# EAGLE design box2043_rfm96V4 (EAGLE 8.6.1)
Tiny TX Node for RMD Box 2043
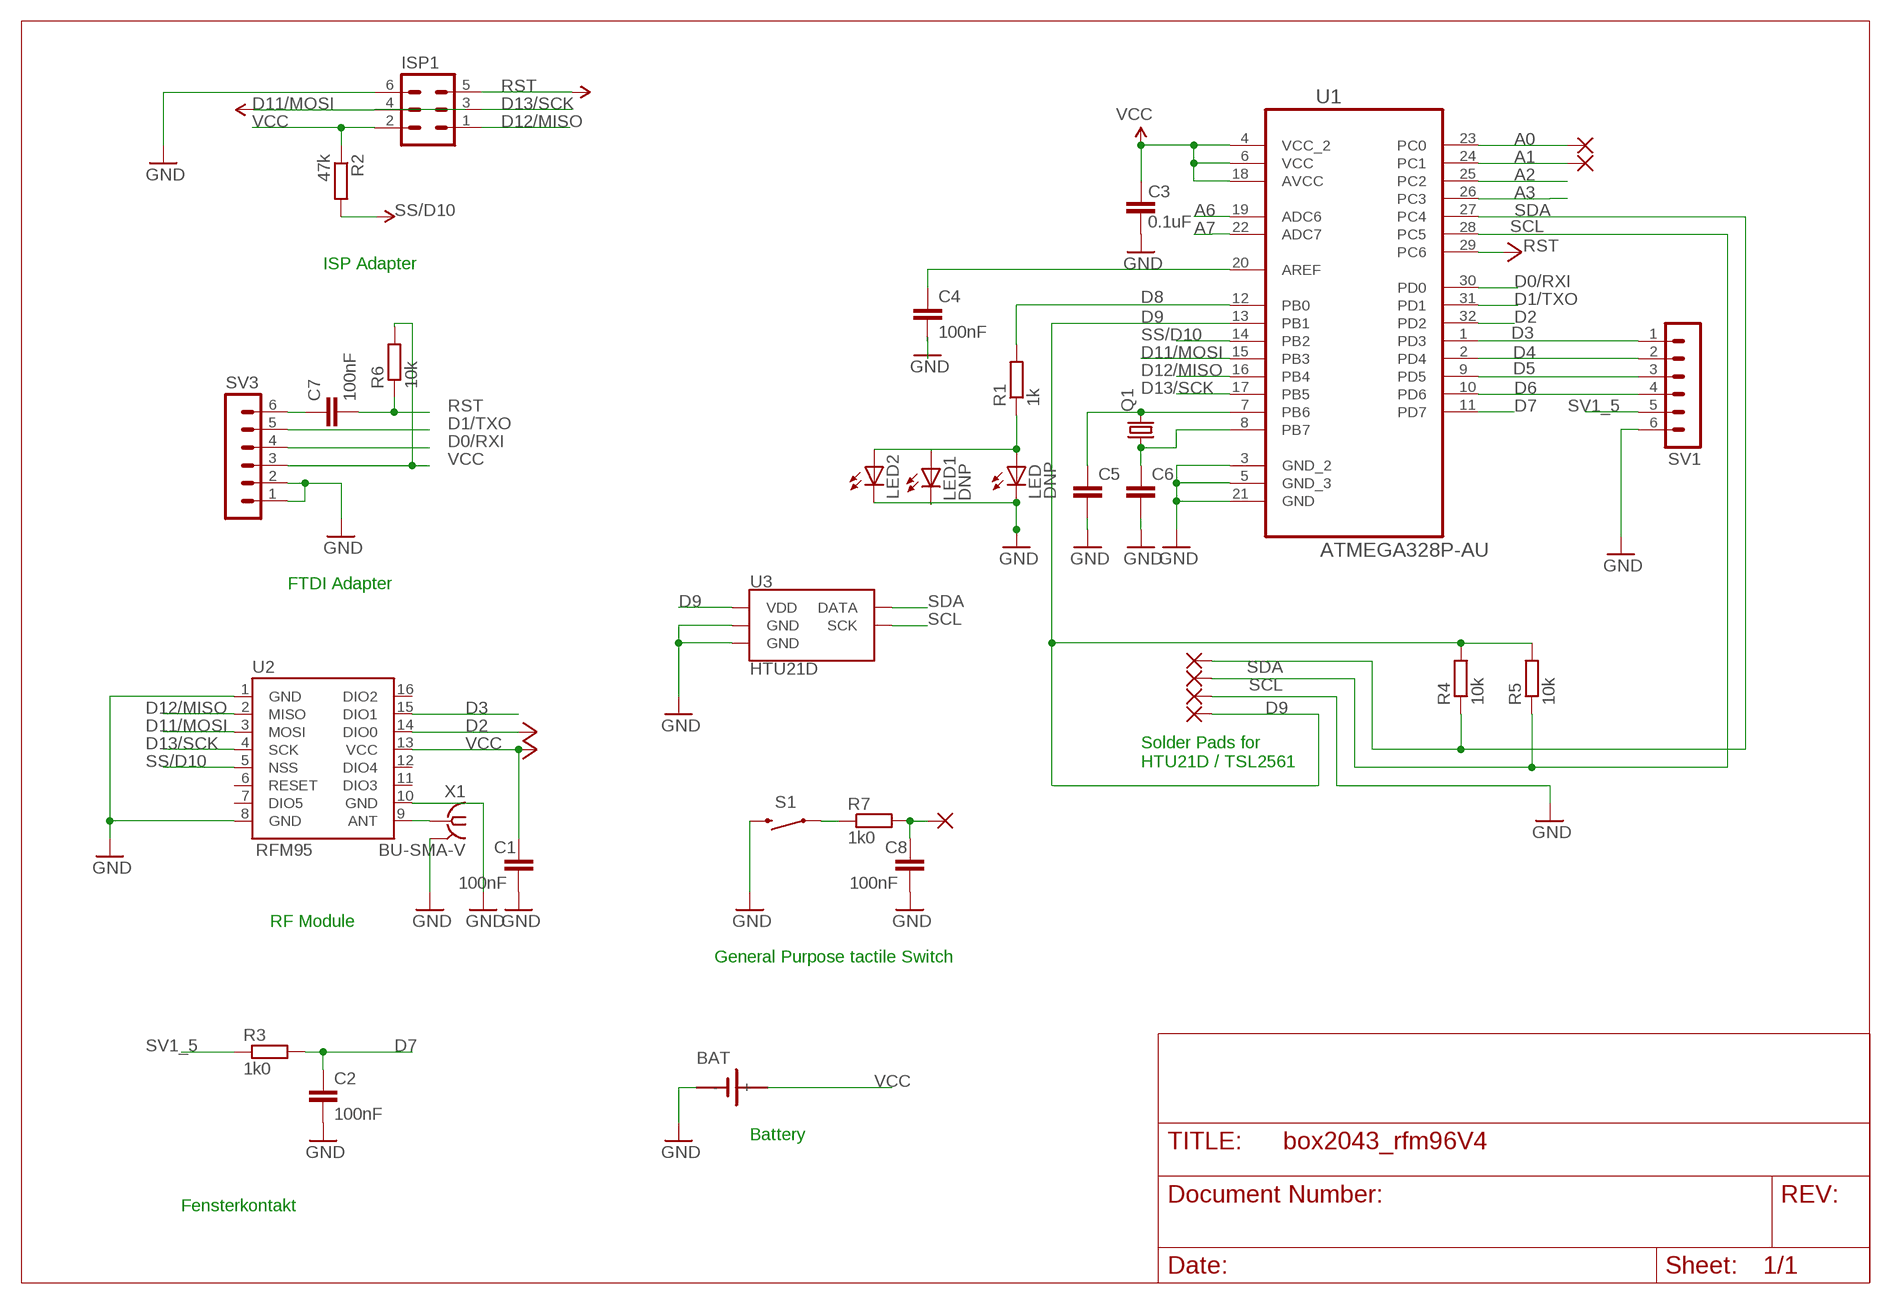
[diagram p0: schematic, sheet 1]

## Parts
A0  SMD2  [SMD1,27-2,54]
A1  SMD2  [SMD1,27-2,54]
BAT  SN2032  [SN2032]
C1  100nF  C-EUC0603  [C0603]
C2  100nF  C-EUC0603  [C0603]
C3  0.1uF  CAP0603-CAP  [0603-CAP]
C4  100nF  C-EUC0603  [C0603]
C5  C-EUC0402  [C0402]
C6  C-EUC0402  [C0402]
C7  100nF  C-EUC0603  [C0603]
C8  100nF  C-EUC0603  [C0603]
D9  SMD2  [SMD1,27-2,54]
GND  SMD2  [SMD1,27-2,54]
ISP1  MA03-2  [MA03-2]
LED  DNP  LEDCHIPLED_0603  [CHIPLED_0603]
LED1  DNP  LED3MM  [LED3MM]
LED2  LEDCHIPLED_0603  [CHIPLED_0603]
N1  SMD2  [SMD1,27-2,54]
Q1  CRYSTALTC26V  [TC26V]
R1  1k  R-EU_R0603  [R0603]
R2  47k  R-EU_R0603  [R0603]
R3  1k0  R-EU_R0603  [R0603]
R4  10k  R-EU_R0603  [R0603]
R5  10k  R-EU_R0603  [R0603]
R6  10k  R-EU_R0603  [R0603]
R7  1k0  R-EU_R0603  [R0603]
S1  MOMENTARY-SWITCH-SPST-PTH-RIGHT-ANGLE  [TACTILE_SWITCH_PTH_RIGHT_ANGLE]
SCL  SMD2  [SMD1,27-2,54]
SDA  SMD2  [SMD1,27-2,54]
SV1  MA06-1  [MA06-1]
SV3  MA06-1  [MA06-1]
U1  ATMEGA328P-AU  [QFP80P900X900X120-32N]
U2  RFM95  [RFM95/96]
U3  HTU21D  [DFN-6-3X3-HTU21D]
X1  BU-SMA-V  [BU-SMA-V]

## Nets
A0: A0.1(P) U1.23(PC0)
A1: A1.1(P) U1.24(PC1)
A2: U1.25(PC2)
A3: U1.26(PC3)
A6: U1.19(ADC6)
A7: U1.22(ADC7)
D0/RXI: SV3.4 U1.30(PD0)
D1/TXO: SV3.5 U1.31(PD1)
D2: U1.32(PD2) U2.14(DIO0)
D3: SV1.1 U1.1(PD3) U2.15(DIO1)
D4: SV1.2 U1.2(PD4)
D5: SV1.3 U1.9(PD5)
D6: SV1.4 U1.10(PD6)
D7: C2.1 R3.2 U1.11(PD7)
D8: R1.2 U1.12(PB0)
D9: D9.1(P) R4.2 R5.2 U1.13(PB1) U3.VDD
D11/MOSI: ISP1.4 U1.15(PB3) U2.3(MOSI) ; supply symbol labelled D13/SCK
D12/MISO: ISP1.1 U1.16(PB4) U2.2(MISO)
D13/SCK: ISP1.3 U1.17(PB5) U2.4(SCK)
DTR: C7.1 SV3.6
GND: BAT.- C1.2 C2.2 C3.1 C4.2 C5.2 C6.2 C8.2 GND.1(P) ISP1.6 LED1.K(C) LED2.C LED.C S1.2 SV1.6 SV3.1 SV3.2 U1.3(GND_2) U1.5(GND_3) U1.21(GND) U2.1(GND) U2.8(GND) U2.10(GND) U3.7(GND) U3.GND X1.2 X1.3 X1.4 X1.5
N$1: U2.9(ANT) X1.1
N$4: C5.1 Q1.2 U1.7(PB6)
N$6: C4.1 U1.20(AREF)
N$7: R7.1 S1.1
N$8: LED1.A LED2.A LED.A R1.1
N$9: C6.1 Q1.1 U1.8(PB7)
N$10: C8.1 N1.1(P) R7.2
RST: C7.2 ISP1.5 R6.1 U1.29(PC6) ; supply symbol labelled VCC
SCL: R5.1 SCL.1(P) U1.28(PC5) U3.SCK
SDA: R4.1 SDA.1(P) U1.27(PC4) U3.DATA
SS/D10: R2.2 U1.14(PB2) U2.5(NSS) ; supply symbol labelled VCC
SV1_5: R3.1 SV1.5
VCC: BAT.+ C1.1 C3.2 ISP1.2 R2.1 R6.2 SV3.3 U1.4(VCC_2) U1.6(VCC) U1.18(AVCC) U2.13(VCC)
Unconnected: U2.7(DIO5) U2.11(DIO3) U2.12(DIO4) U2.16(DIO2)

## Notes on the sheet
- ISP Adapter
- FTDI Adapter
- Solder Pads for
  HTU21D / TSL2561
- RF Module
- General Purpose tactile Switch
- Battery
- Fensterkontakt

## Power pins joined to a net without a drawn wire
RESET: U2.6(RESET)

## Library data of the parts
A0 A1 D9 GND N1 SCL SDA = wirepad:SMD2: SMD PAD
BAT = sn2032_AH:SN2032: LI BATTERY
C1 C2 C4-C8 = rcl:C-EU: CAPACITOR, European symbol; SPICEPREFIX: C
C3 = SparkFun:CAP: Capacitor Standard 0603 ceramic capacitor, and 0.1" leaded capacitor.
ISP1 = con-lstb:MA03-2: PIN HEADER; OC_FARNELL: unknown; OC_NEWARK: unknown
LED LED1 LED2 = led:LED: LED OSRAM: - CHIPLED LG R971, LG N971, LY N971, LG Q971, LY Q971, LO R971, LY R971 LH N974, LH R974 LS Q976, LO Q976, LY Q976 LO Q996 - Hyper CHIPLED LW Q18S LB Q993, LB Q99A, LB R99A - SideLED LS A670, LO A670, LY A670, LG A670, LP A670 LB A673, LV A673, LT A673, LW A673 LH A674 LY A675 LS A676, LA A676, LO A676, LY A676, LW A676 LS A679, LY A679, LG A679 - Hyper Micro SIDELED® LS Y876, LA Y876, LO Y876, LY Y876 LT Y87S - SmartLED LW L88C, LW L88S LB L89C, LB L89S, LG L890 LS L89K, LO L89K, LY L89K LS L896, LA L896, LO L896, LY L896 - TOPLED LS T670, LO T670, LY T670, LG T670, LP T670 LSG T670, LSP T670, LSY T670, LOP T670, LYG T670 LG T671, LOG T671, LSG T671 LB T673, LV T673, LT T673, LW T673 LH T674 LS T676, LA T676, LO T676, LY T676, LB T676, LH T676, LSB T676, LW T676 LB T67C, LV T67C, LT T67C, LS T67K, LO T67K, LY T67K, LW E67C LS E67B, LA E67B, LO E67B, LY E67B, LB E67C, LV E67C, LT E67C LW T67C LS T679, LY T679, LG T679 LS T770, LO T770, LY T770, LG T770, LP T770 LB T773, LV T773, LT T773, LW T773 LH T774 LS E675, LA E675, LY E675, LS T675 LS T776, LA T776, LO T776, LY T776, LB T776 LHGB T686 LT T68C, LB T68C - Hyper Mini TOPLED® LB M676 - Mini TOPLED Santana® LG M470 LS M47K, LO M47K, LY M47K Source: http://www.osram.convergy.de LUXEON: - LUMILED® LXK2-PW12-R00, LXK2-PW12-S00, LXK2-PW14-U00, LXK2-PW14-V00 LXK2-PM12-R00, LXK2-PM12-S00, LXK2-PM14-U00 LXK2-PE12-Q00, LXK2-PE12-R00, LXK2-PE12-S00, LXK2-PE14-T00, LXK2-PE14-U00 LXK2-PB12-K00, LXK2-PB12-L00, LXK2-PB12-M00, LXK2-PB14-N00, LXK2-PB14-P00, LXK2-PB14-Q00 LXK2-PR12-L00, LXK2-PR12-M00, LXK2-PR14-Q00, LXK2-PR14-R00 LXK2-PD12-Q00, LXK2-PD12-R00, LXK2-PD12-S00 LXK2-PH12-R00, LXK2-PH12-S00 LXK2-PL12-P00, LXK2-PL12-Q00, LXK2-PL12-R00 Source: www.luxeon.com KINGBRIGHT: KA-3528ASYC Source: www.kingbright.com
Q1 = crystal:CRYSTAL: CRYSTAL; OC_FARNELL: unknown; OC_NEWARK: unknown
R1-R7 = rcl:R-EU_: RESISTOR, European symbol
S1 = SparkFun-Switches:MOMENTARY-SWITCH-SPST: Momentary Switch (Pushbutton) - SPST Normally-open (NO) SPST momentary switches (buttons, pushbuttons). Variants PTH-12MM - 12mm square, through-hole Momentary Pushbutton Switch - 12mm Square <https://www.sparkfun.com/products/9190> (COM-09190) PTH-6.0MM, PTH-6.0MM-KIT - 6.0mm square, through-hole Mini Pushbutton Switch <https://www.sparkfun.com/products/97> (COM-00097) KIT package intended for soldering kit's - only one side of pads' copper is exposed. PTH-RIGHT-ANGLE-KIT - Right-angle, through-hole Right Angle Tactile Button <https://www.sparkfun.com/products/10791> - Used on SparkFun BigTime Watch Kit <https://www.sparkfun.com/products/11734> SMD-12MM - 12mm square, surface-mount Tactile Button - SMD (12mm) <https://www.sparkfun.com/products/12993> (COM-12993) Used on SparkFun PicoBoard <https://www.sparkfun.com/products/11888> SMD-4.5MM - 4.5mm Square Trackball Switch Used on SparkFun Blackberry Trackballer Breakout <https://www.sparkfun.com/products/13169> SMD-4.6MMX2.8MM - 4.60mm x 2.80mm, surface mount Used on SparkFun SAMD21 Mini Breakout <https://www.sparkfun.com/products/13664> SMD-5.2MM, SMD-5.2-REDUNDANT - 5.2mm square, surface-mount Mini Pushbutton Switch - SMD <https://www.sparkfun.com/products/8720> (COM-08720) Used on Arduino Pro Mini <https://www.sparkfun.com/products/11114> REDUNDANT package connects both switch circuits together SMD-6.0X3.5MM - 6.0 x 3.5mm, surface mount Momentary Reset Switch SMD <https://www.sparkfun.com/products/8229> (COM-08229) SMD-6.2MM-TALL - 6.2mm square, surface mount Tactile Button - SMD (6mm) <https://www.sparkfun.com/products/12992> Used on SparkFun Digital Sandbox <https://www.sparkfun.com/products/12651> SMD-RIGHT-ANGLE - Right-angle, surface mount Used on SparkFun Block for Intel® Edison - Arduino <https://www.sparkfun.com/products/13036>; PROD_ID: CONN-10672; SF_SKU: COM-10791
SV1 SV3 = con-lstb:MA06-1: PIN HEADER; OC_FARNELL: unknown; OC_NEWARK: unknown
U1 = Atmel_By_element14_Batch_1-00:ATMEGA328P-AU: 8-bit Microcontroller with In-System Programmable Flash; MPN: ATMEGA328P-AU; OC_FARNELL: 1715486; OC_NEWARK: 14R4631; PACKAGE: TQFP-32; SUPPLIER: Atmel
U2 = RFM69xx:RFM95: Low Power Long Range Transceiver Module. The RFM95/96/97/98(W) transceivers feature the LoRaTM long range modem that provides ultra-long range spread spectrum communication and high interference immunity whilst minimising current consumption.
U3 = SparkFun-Sensors:HTU21D: Measurement Specialties HTU21D Relative Humidity Sensor w/ Temperature HTU21D(F) digital humidity sensors are dedicated humidity and temperature plug and play transducers for OEM applications where reliable and accurate measurements are needed. Direct interface with a micro-controller is made possible with the module for humidity and temperature digital outputs. These low power sensors are designed for high volume and cost sensitive applications with tight space constraints. Datasheet <http://cdn.sparkfun.com/datasheets/BreakoutBoards/HTU21D.pdf> SparkFun Products SparkFun Humidity and Temperature Sensor Breakout - HTU21D <https://www.sparkfun.com/products/12064> (SEN-12064) SparkFun Weather Shield <https://www.sparkfun.com/products/12081> (SEN-12081) SparkFun Photon Weather Shield <https://www.sparkfun.com/products/13630> (SEN-13630); PROD_ID: IC-11793
X1 = con-coax:BU-SMA-V: FEMALE SMA CONNECTOR Radiall distributor RS 112-3794; OC_FARNELL: unknown; OC_NEWARK: unknown

## Net classes
1 vcc: width 0.254 mm

## Board
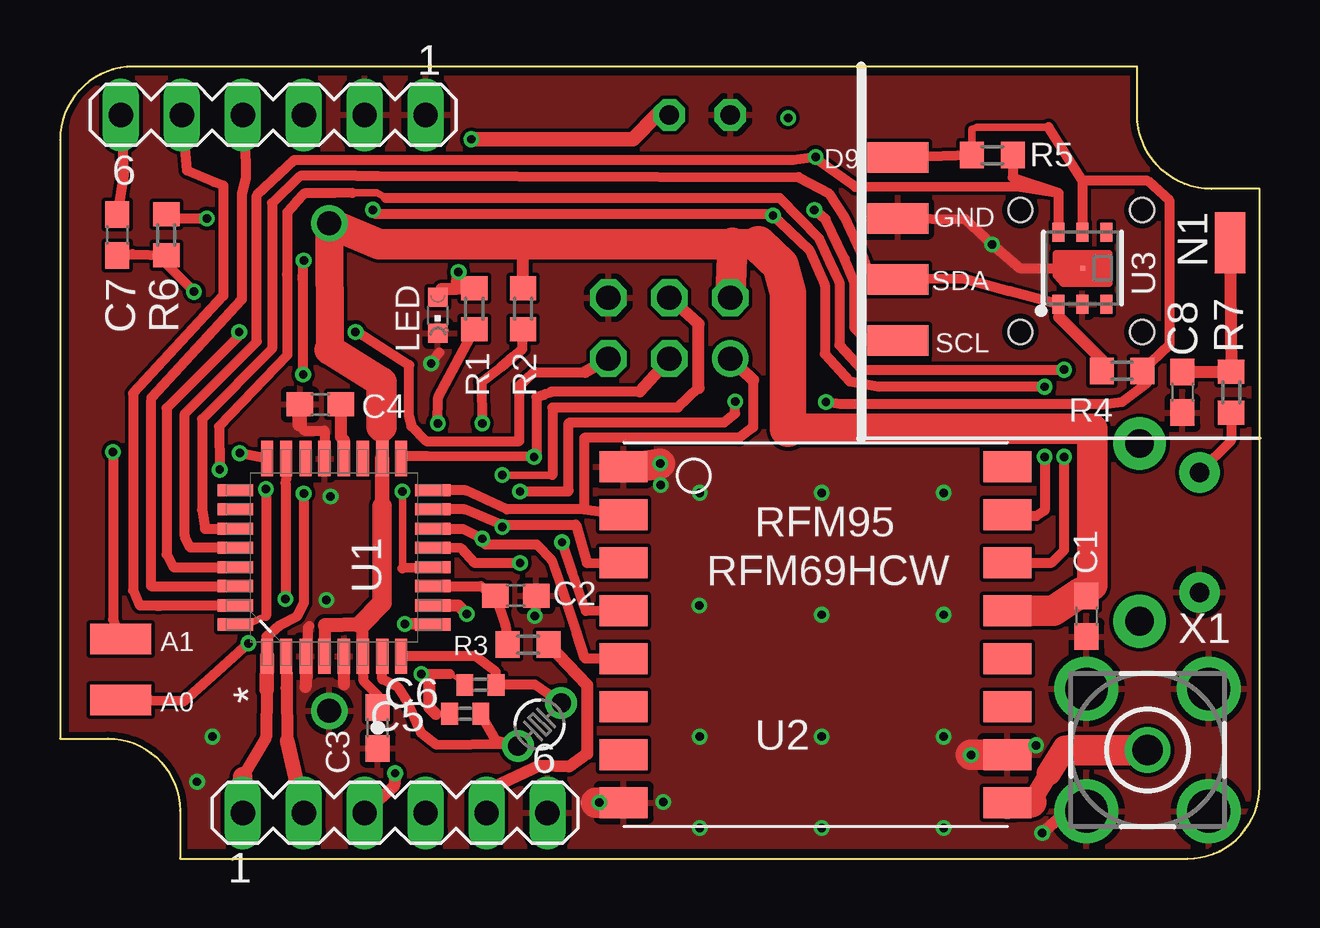
[diagram p1: board, top side]
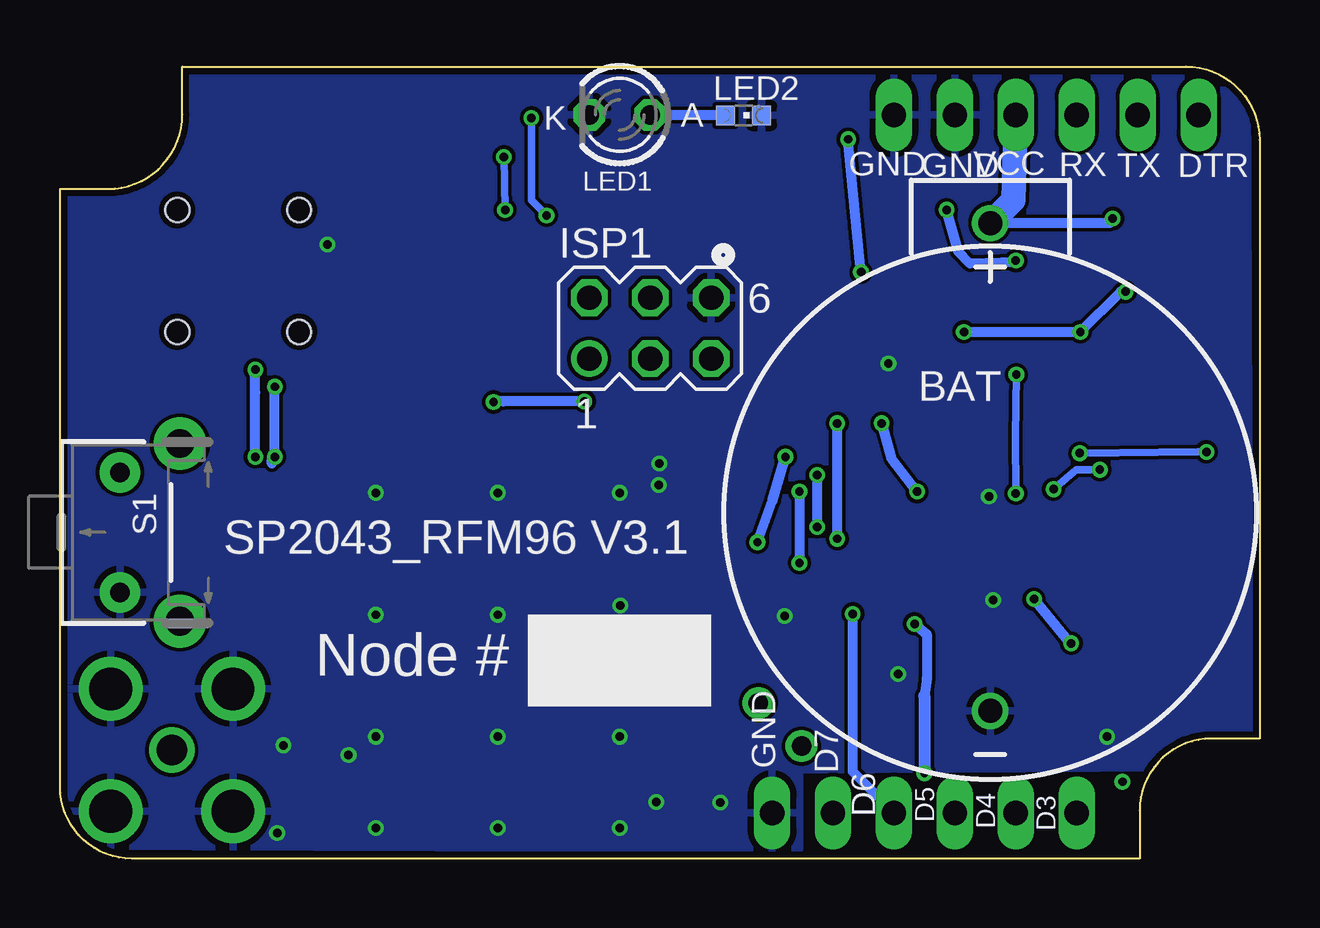
[diagram p2: board, bottom side, seen from below]

Size 50 x 33 mm. Coordinates in mm from the lower left corner, seen from the top.
Outline: 50,27.9 48,27.9 arc-90 44.9,31 44.9,33 3.06,33 arc90 0,29.93 0,5 2,5 arc-90 5,2 5,0 47,0 arc90 50,3 50,27.9
Copper layers (1*16): Top 0.035mm / dielectric 1.5mm / Bottom 0.035mm
Design rules "SeeedStudio_2layer_DRU_no_angle_20140221": minimum track width 6mil, minimum drill 12mil, track to track 6mil, track to pad 6mil, pad to pad 6mil, via to via 6mil, smd to smd 0mil, copper to edge 10mil, drill to drill 10mil, minimum pad ring 10mil, minimum via ring 6mil, stop-mask expansion 2mil, vias tented up to drill 100mil, thermal gap 10mil
Holes 1 mm at 45.11,27.03 40.03,27.03 45.11,21.95 40.03,21.95

### Footprints (pad centres in the part's own frame; a part is rotated, then mirrored left to right if it is on the bottom)
SMD1,27-2,54 = smd 1.27 x 2.54: 1 0,0
SN2032 = drill 1: + 0,12.065; - 0,-8.255
C0603 = smd 1.1 x 1: 1 -0.85,0; 2 0.85,0
0603-CAP = smd 1.1 x 1: 1 -0.85,0; 2 0.85,0
C0402 = smd 0.7 x 0.9: 1 -0.65,0; 2 0.65,0
MA03-2 = drill 1.016: 1 -2.54,-1.27 | drill 1.016 octagon: 2 -2.54,1.27; 3 0,-1.27; 4 0,1.27; 5 2.54,-1.27; 6 2.54,1.27
CHIPLED_0603 = smd 0.8 x 0.8: A 0,-0.75; C 0,0.75
LED3MM = drill 0.813 octagon: A -1.27,0; K 1.27,0
TC26V = drill 0.813: 1 -1.27,0; 2 1.27,0
R0603 = smd 1 x 1.1: 1 -0.85,0; 2 0.85,0
TACTILE_SWITCH_PTH_RIGHT_ANGLE = drill 0.8 pad 1.7: 1 -2.5,0; 2 2.5,0 | drill 1.2 pad 2.2: ANCHOR1 -3.703,2.5; ANCHOR2 3.703,2.5
MA06-1 = drill 1.016 long: 1 -6.35,0; 2 -3.81,0; 3 -1.27,0; 4 1.27,0; 5 3.81,0; 6 6.35,0
QFP80P900X900X120-32N = smd 1.473 x 0.508: 1 -4.115,2.794; 2 -4.115,2.007; 3 -4.115,1.194; 4 -4.115,0.406; 5 -4.115,-0.406; 6 -4.115,-1.194; 7 -4.115,-2.007; 8 -4.115,-2.794; 17 4.115,-2.794; 18 4.115,-2.007; 19 4.115,-1.194; 20 4.115,-0.406; 21 4.115,0.406; 22 4.115,1.194; 23 4.115,2.007; 24 4.115,2.794 | smd 0.508 x 1.473: 9 -2.794,-4.115; 10 -2.007,-4.115; 11 -1.194,-4.115; 12 -0.406,-4.115; 13 0.406,-4.115; 14 1.194,-4.115; 15 2.007,-4.115; 16 2.794,-4.115; 25 2.794,4.115; 26 2.007,4.115; 27 1.194,4.115; 28 0.406,4.115; 29 -0.406,4.115; 30 -1.194,4.115; 31 -2.007,4.115; 32 -2.794,4.115
RFM95/96 = smd 2 x 1.3: 1 -8,8; 2 -8,6; 3 -8,4; 4 -8,2; 5 -8,0; 6 -8,-2; 7 -8,-4; 8 -8,-6; 9 8,-6; 10 8,-4; 11 8,-2; 12 8,0; 13 8,2; 14 8,4; 15 8,6; 16 8,8
DFN-6-3X3-HTU21D = smd 0.2 x 0.2: 7 0,0 | smd 0.8 x 0.5: DATA 1.5,-1; GND 1.5,0; NC@1 -1.5,1; NC@6 1.5,1; SCK -1.5,-1; VDD -1.5,0
BU-SMA-V = drill 1.27: 1 0,0 | drill 1.778: 2 -2.55,2.55; 3 2.55,2.55; 4 2.55,-2.55; 5 -2.55,-2.55

### Placement (x,y rotation side)
A0  2.54,6.6 90 top
A1  2.54,9.14 90 top
BAT  11.23,14.41 0 bottom
C1  42.79,10.1 270 top
C2  19,10.95 0 top
C3  13.24,5.44 90 top
C4  10.86,18.93 180 top
C5  16.89,6.03 180 top
C6  17.53,7.24 180 top
C7  2.38,25.98 270 top
C8  46.79,19.43 270 top
D9  34.92,29.21 90 top
GND  34.92,26.67 90 top
ISP1  25.4,22.1 0 bottom
LED  15.75,22.64 180 top
LED1  26.67,30.99 180 bottom
LED2  21.51,30.96 270 bottom
N1  48.77,25.65 0 top
Q1  19.99,5.59 225 top
R1  17.27,22.91 270 top
R2  19.3,22.91 270 top
R3  19.51,8.92 180 top
R4  44.27,20.32 0 top
R5  38.86,29.31 180 top
R6  4.43,25.99 90 top
R7  48.82,19.43 90 top
S1  47.5,13.59 270 bottom
SCL  34.92,21.59 90 top
SDA  34.92,24.13 90 top
SV1  13.97,1.91 0 top
SV3  8.89,30.99 180 top
U1  11.43,12.55 90 top
U2  31.5,8.33 0 top
U3  42.62,24.6 270 top
X1  45.34,4.52 0 top

### Tracks (layer width: path | path; a pad name or v marks a point on that pad's centre or on a via)
A0  (via drill 0.35)
  Top 0.305: 9.42,15.77 9.4,15.65
  Top 0.406: U1.23 9.42,15.77 | 9.4,15.65 v9.4,10.81 | v7.85,8.97 6.35,7.62 5.16,6.55 A0.1
  Bottom 0.254: 7.9,8.97 v7.85,8.97
  Bottom 0.406: v9.4,10.81 7.9,8.97
A1  (via drill 0.35)
  Top 0.406: U1.24 v7.49,16.89 | v2.21,16.94 2.21,9.96 A1.1
  Bottom 0.305: v7.49,16.89 2.56,16.94 v2.21,16.94
D0/RXI
  Top 0.305: 3.82,19.21 3.79,19.25 3.79,19.24 3.79,19.2 3.79,19.05
  Top 0.406: U1.30 7.11,11.35 3.79,11.35 3.79,19.05 | 3.82,19.21 7.57,23.29 7.57,27.69 7.75,28.36 7.75,28.98 SV3.4
D1/TXO
  Top 0.406: U1.31 4,10.54 4.22,10.54 3.33,10.54 3.05,11.17 3.05,19.39 6.81,23.45 6.81,28.05 6.43,28.19 5.28,28.68 SV3.5
D2  (via drill 0.35)
  Top 0.152: 9.47,26.7 9.47,26.93
  Top 0.305: 13.59,27.53 13.21,27.74 12.19,27.74 | 8.59,10.11 7.88,9.78 7.63,9.77 | 7.63,9.77 7.19,9.75 | U1.32 7.33,9.77 7.63,9.77
  Top 0.406: U2.14 41.34,12.33 41.86,12.85 v41.86,16.74 | v41.86,20.37 33.45,20.37 32.49,21.41 32.49,24.03 32.11,24.82 31.65,25.83 30,27.53 13.59,27.53 | v6.66,16.2 6.63,18.01 9.47,20.98 9.47,23.96 9.47,24.34 9.47,25.57 9.47,26.93 9.84,27.34 10.19,27.71 11.43,27.72 12.19,27.74 | v8.59,15.39 8.59,10.11
  Bottom 0.305: v8.59,15.39 7.64,16.2 v6.66,16.2
  Bottom 0.406: v41.86,16.74 41.86,19.43 v41.86,20.37
D3  (via drill 0.35)
  Top 0.152: 10.13,24.13 10.11,24.16 | v29.72,26.8 29.67,26.85 29.21,26.85
  Top 0.305: 39.5,14.28 U2.15 | 29.69,26.85 29.72,26.72
  Top 0.406: U1.1 8.61,9.25 9.13,9.69 9.87,10.08 10.16,10.64 v10.16,15.21 | v10.13,20.17 10.13,24.13 10.13,24.45 | 39.5,14.28 40.72,14.28 41.05,14.5 v41.05,16.74 | v41.05,19.66 34.19,19.66 32.92,19.89 31.88,21.02 31.88,23.9 31.25,25.34 30,26.53 29.69,26.85 29.21,26.85 13.15,26.85 v13.04,27.03 | 10.11,24.16 v10.16,24.92
  Top 0.508: 8.61,7.03 8.59,5.06 7.62,3.4
  Top 0.61: 8.61,7.03 U1.1
  Top 0.813: 7.62,3.4 SV1.1
  Bottom 0.305: v10.16,15.21 10.19,17.6 v10.13,20.17 | v41.05,16.74 41.05,16.82 | v30.35,30.86 30.35,27.43 v29.72,26.8
  Bottom 0.406: 41.05,16.82 v41.05,19.66 | v10.16,24.92 10.19,24.84 12.06,24.79 12.56,25.29 v13.04,27.03 | 41.18,16.46 41.18,16.61 v41.05,16.74
D4
  Top 0.508: U1.2 9.45,7.12 9.46,4.91
  Top 0.61: 9.46,4.91 SV1.2
D5  (via drill 0.35)
  Top 0.406: v13.97,3.56 13.97,3.53
  Top 0.508: U1.9 v14.38,9.78 | 13.97,3.53 13.97,3.4 13.92,3.02 SV1.3
  Bottom 0.406: v14.38,9.78 13.87,9.35 13.87,7.52 13.97,6.78
  Bottom 0.508: 13.97,6.78 v13.97,3.56
D6  (via drill 0.35)
  Top 0.508: v16.95,10.2 16.61,10.54 U1.10
  Bottom 0.406: SV1.4 16.95,3.62 v16.95,10.2
D7
  Top 0.152: C2.1 17.99,10.93 17.64,11.28
  Top 0.406: U1.11 17.55,11.35 17.64,11.28 18.16,10.79 | C2.1 18.57,9.71 R3.2
D8  (via drill 0.35)
  Top 0.305: 14.28,12.09 v14.28,15.29
  Top 0.406: U1.12 14.28,12.09 | v15.75,18.14 15.77,19.21 R1.2
  Bottom 0.406: v14.28,15.29 15.32,16.64 v15.75,18.14
D9  (via drill 0.35)
  Top 0.152: 45.1,20.34 R4.2 | D9.1 35.56,29.17
  Top 0.305: U1.13 16.74,12.93 | R5.2 38.01,30.39 38.23,30.48 41.2,30.48
  Top 0.406: v28.14,19.05 28.14,18.54 27.69,18.16 21.21,18.16 21.21,15.34 21.19,15.29 v19.18,15.29 | 16.04,12.95 16.74,12.93 17.29,12.32 v19.18,12.32 | 42.62,28.24 U3.VDD | 42.62,28.24 45.34,28.24 46.25,27.41 46.25,21.4 R4.2 | v31.93,19.02 32.54,18.95 43.66,18.95 43.46,18.92 44.28,19.02 45.29,19.79 45.12,19.95 45.1,20.34 | 41.2,30.48 42.62,28.24 | R5.2 D9.1
  Bottom 0.305: 19.18,12.21 v19.18,12.32
  Bottom 0.406: v31.93,19.02 31.77,19.05 31.52,19.05 v28.14,19.05 | v19.18,15.29 19.18,12.21
D11/MOSI  (via drill 0.35)
  Top 0.152: U2.3 23.76,12.33 24.13,12.7 | 25.36,23.41 ISP1.4
  Top 0.305: 20.52,15.98 v18.44,15.98 | v18.44,13.82 17.69,14.2 18.39,13.92
  Top 0.406: U2.3 21.96,12.31 21.5,13.92 18.39,13.92 16.87,14.55 U1.15 | 20.52,15.98 20.52,18.8 25.76,18.8 26.62,19.61
  Top 0.508: 26.62,19.61 26.62,22.28 25.36,23.41
  Bottom 0.406: v18.44,15.98 v18.44,13.82
D12/MISO
  Top 0.406: 21.84,14.55 U2.2 | 21.84,14.55 18.62,14.55 16.92,15.34 U1.16 | 28.89,19.94 28.89,17.97 28.32,17.53 21.84,17.53 21.84,14.55
  Top 0.508: 28.89,19.94 ISP1.1
D13/SCK  (via drill 0.35)
  Top 0.305: 21.36,11.91 21.34,11.96
  Top 0.406: U2.4 21.93,10.31 21.36,11.91 | U1.17 14.43,16.76 15.29,16.76 v19.76,16.74 19.86,16.63 19.86,19.24 20.23,19.36 20.44,19.42 20.47,19.46 24.16,19.46 | 21.34,11.96 v20.93,13.18
  Top 0.508: ISP1.3 24.16,19.46
  Bottom 0.406: v20.93,13.18 20.29,14.91 v19.76,16.74
DTR
  Top 0.406: SV3.6 2.65,28.5 C7.1
GND  (via drill 0.35)
  Top 0.203: 16.26,7.7 16.76,7.37 | 15.66,6.03 C5.2
  Top 0.305: U2.1 23.62,16.51 24.13,16.51 | 39.46,4.33 U2.10 | 16.76,7.37 C6.2
  Top 0.406: 9.98,18.09 10.19,17.83 11.02,17.83 U1.21 | GND.1 37.72,26.64 v38.85,25.59 40.01,24.6 U3.7 | 19.85,10.1 C2.2 | v15.47,20.62 15.81,21.09 | 10.34,7.55 10.34,9.64 10.39,9.68 | v15.06,7.7 16.26,7.7
  Top 0.508: 11.84,7.25 U1.5 | U1.3 10.24,7.14 | v40.95,1.07 41.94,1.93 X1.5 | v15.06,7.7 15.39,7.37 15.39,6.3 15.66,6.03
  Top 0.61: C4.2 9.98,18.09
  Top 0.813: 22.35,2.33 v22.48,2.34
  Top 1.016: U2.1 24.13,16.33
  Top 1.27: 24.13,16.33 v25.02,16.46 | 39.46,4.33 v37.97,4.32 | U2.8 22.35,2.33
  other vias: 25.15,2.36 25.04,15.57 40.69,4.72 19.79,10.11 11.28,15.09 11.1,10.77 6.35,5.08 5.71,3.2 26.67,15.24 31.75,15.24 36.83,15.24 31.75,10.16 36.83,10.16 26.67,5.08 31.75,5.08 36.83,5.08 26.67,1.27 31.75,1.27 36.83,1.27 26.64,10.54
  pour Bottom: 0.51,32.51 49.53,32.51 49.53,0.51 19.18,0.38 19.18,3.68 0.38,3.81
  pour Top: 0.51,0.51 0.51,32.51 49.53,32.51 49.53,0.51
  cutout Top: 14.71,8.05 17.37,8.05 17.37,5.08 14.68,5.08 14.68,8.03
N$1
  Top 0.406: U2.9 39.49,2.29
  Top 0.813: 40.49,2.34 41.22,3.56 | 41.89,4.62 42.07,4.52
  Top 1.016: 41.22,3.56 41.89,4.62
  Top 1.27: 39.49,2.29 40.49,2.34 | 42.07,4.52 X1.1
N$4
  Top 0.406: C5.1 18.17,4.92 Q1.2 18.62,4.78 15.7,4.75 15.04,5.26 14.4,6.66 14.1,7.14 13.44,7.47 U1.7
N$6
  Top 0.406: 11.84,17.45 11.71,17.57
  Top 0.508: U1.20 11.84,17.45 | 11.71,17.57 11.71,17.93 C4.1
N$7
  Top 0.406: R7.1 48.82,17.41 S1.1
N$8  (via drill 0.35)
  Top 0.305: 15.9,23.73 LED.A
  Top 0.508: R1.1 16.51,23.73 | 16.51,23.73 15.9,23.73 | 16.51,23.73 v16.61,24.43
  Top 0.61: v17.15,29.97 23.88,29.97 24.89,30.99 LED1.A
  Bottom 0.406: v16.61,24.43 v17.15,29.97 | LED2.A 25.38,30.96 LED1.A
N$9
  Top 0.406: U1.8 15.24,8.43 17.32,8.43 18.18,7.78 C6.1 19.79,7.25 Q1.1
N$10
  Top 0.508: N1.1 R7.2 C8.1
RST  (via drill 0.35)
  Top 0.305: v7.47,21.95 7.59,21.87 7.47,21.79
  Top 0.406: 7.47,21.79 4.45,18.77 4.45,12.68 4.72,12.14 U1.29 | 21.89,20.27 19.81,20.27 19.74,20.24 19.15,19.71 19.15,17.4 15.27,17.4 14.66,18.01 14.55,18.39 14.55,20.56 12.39,21.95 v12.32,21.95 | C7.2 3.02,25.18 R6.1 4.43,24.78 v5.59,23.62
  Top 0.508: 21.89,20.27 ISP1.5
  Bottom 0.406: v12.32,21.95 v7.47,21.95 5.79,23.62 v5.59,23.62
SCL  (via drill 0.35)
  Top 0.406: U1.28 5.44,12.95 5.21,13.44 5.21,18.54 8.2,21.54 8.2,27.64 9.77,29.11 30.55,29.11 v31.5,29.23 31.52,29.16 33.15,27.99 39.88,28.02 41.62,27.74 | SCL.1 33.63,21.59 33.12,22.09 33.12,24.01 32.7,25 31.91,26.64 v31.45,27.03 | 41.62,27.74 U3.SCK | R5.1 39.71,28.38 41.62,27.74
  Bottom 0.305: v31.45,27.03 v31.5,29.23
SDA
  Top 0.305: U3.DATA 41.64,22.57 | SDA.1 34.37,23.98 | 10.03,28.45 9.96,28.4
  Top 0.406: SDA.1 37.72,24.16 39.6,23.65 U3.DATA | R4.1 43.12,20.31 | 34.37,23.98 33.6,24.69 33.49,25.02 32.67,26.76 32.05,27.72 30.79,28.39 13.26,28.45 12.71,28.45 12.37,28.45 10.03,28.45 | U1.27 6.04,13.74 5.92,14.53 5.92,18.31 8.84,21.23 8.84,27.31 9.96,28.4
  Top 0.508: 41.64,22.57 43.42,20.79 R4.1
SS/D10  (via drill 0.35)
  Top 0.305: 17.73,13.08 17.73,13.21
  Top 0.406: U2.5 21.89,8.33 21.54,9.42 20.98,11.05 20.49,12.45 19.88,13.08 19.55,13.08 17.73,13.08 v17.6,13.33 16.76,13.73 U1.14 | R2.2 19.28,21.23 18.9,20.9 18.38,20.48 17.57,19.85 v17.6,18.14
  Bottom 0.406: v17.6,13.33 v17.6,18.14
SV1_5
  Top 0.152: 17.73,1.96 SV1.5
  Top 0.508: R3.1 21.97,7.23 21.97,4.36 21.21,3.83 19.99,3.86 17.75,2.82 17.73,1.96
VCC  (via drill 0.35)
  Top 0.152: 28.03,25.67 29.11,25.6 | 19.3,25.6 18.8,25.6
  Top 0.305: 12.55,9.75 12.62,9.83 | 42.93,11.39 42.58,11.1 43.03,11.39 | 13.49,17.65 13.49,17.7 13.41,17.98
  Top 0.406: U1.6 12.66,7.4 13.24,6.8 C3.2 | R6.2 arc90 4.6,26.67 v6.12,26.67
  Top 0.508: U1.4 11.05,9.73 | U1.6 12.62,9.83 | U1.18 13.49,17.65 | R2.1 19.3,25.6
  Top 0.61: 13.44,14.68 U1.18 | 12.55,9.75 11.05,9.73
  Top 0.813: 13.44,14.68 13.44,10.67 12.55,9.75
  Top 1.016: C1.1 42.93,11.39
  Top 1.168: BAT.+ 11.23,21.19
  Top 1.27: U2.13 41.41,10.32 42.58,11.1 | 43.03,11.39 43.03,17.91 30.35,17.91 | 11.23,21.19 13.41,19.84 13.41,17.98 | 29.11,25.6 18.8,25.6 13.31,25.6 BAT.+ | ISP1.2 28.03,25.67
  Top 1.524: 29.11,25.6 30.02,24.71 30.35,23.57 30.35,17.91
  Bottom 0.406: v6.12,26.67 arc90 6.32,26.47 BAT.+
  Bottom 1.016: SV3.3 10.27,27.43 BAT.+

### Text on the board
tPlace: RFM69HCW
bPlace: A | K | VCC | DTR | TX | RX | GND | GND | SP2043_RFM96 V3.1 | Node # | D6 | D7 | GND | D3 | D4 | D5